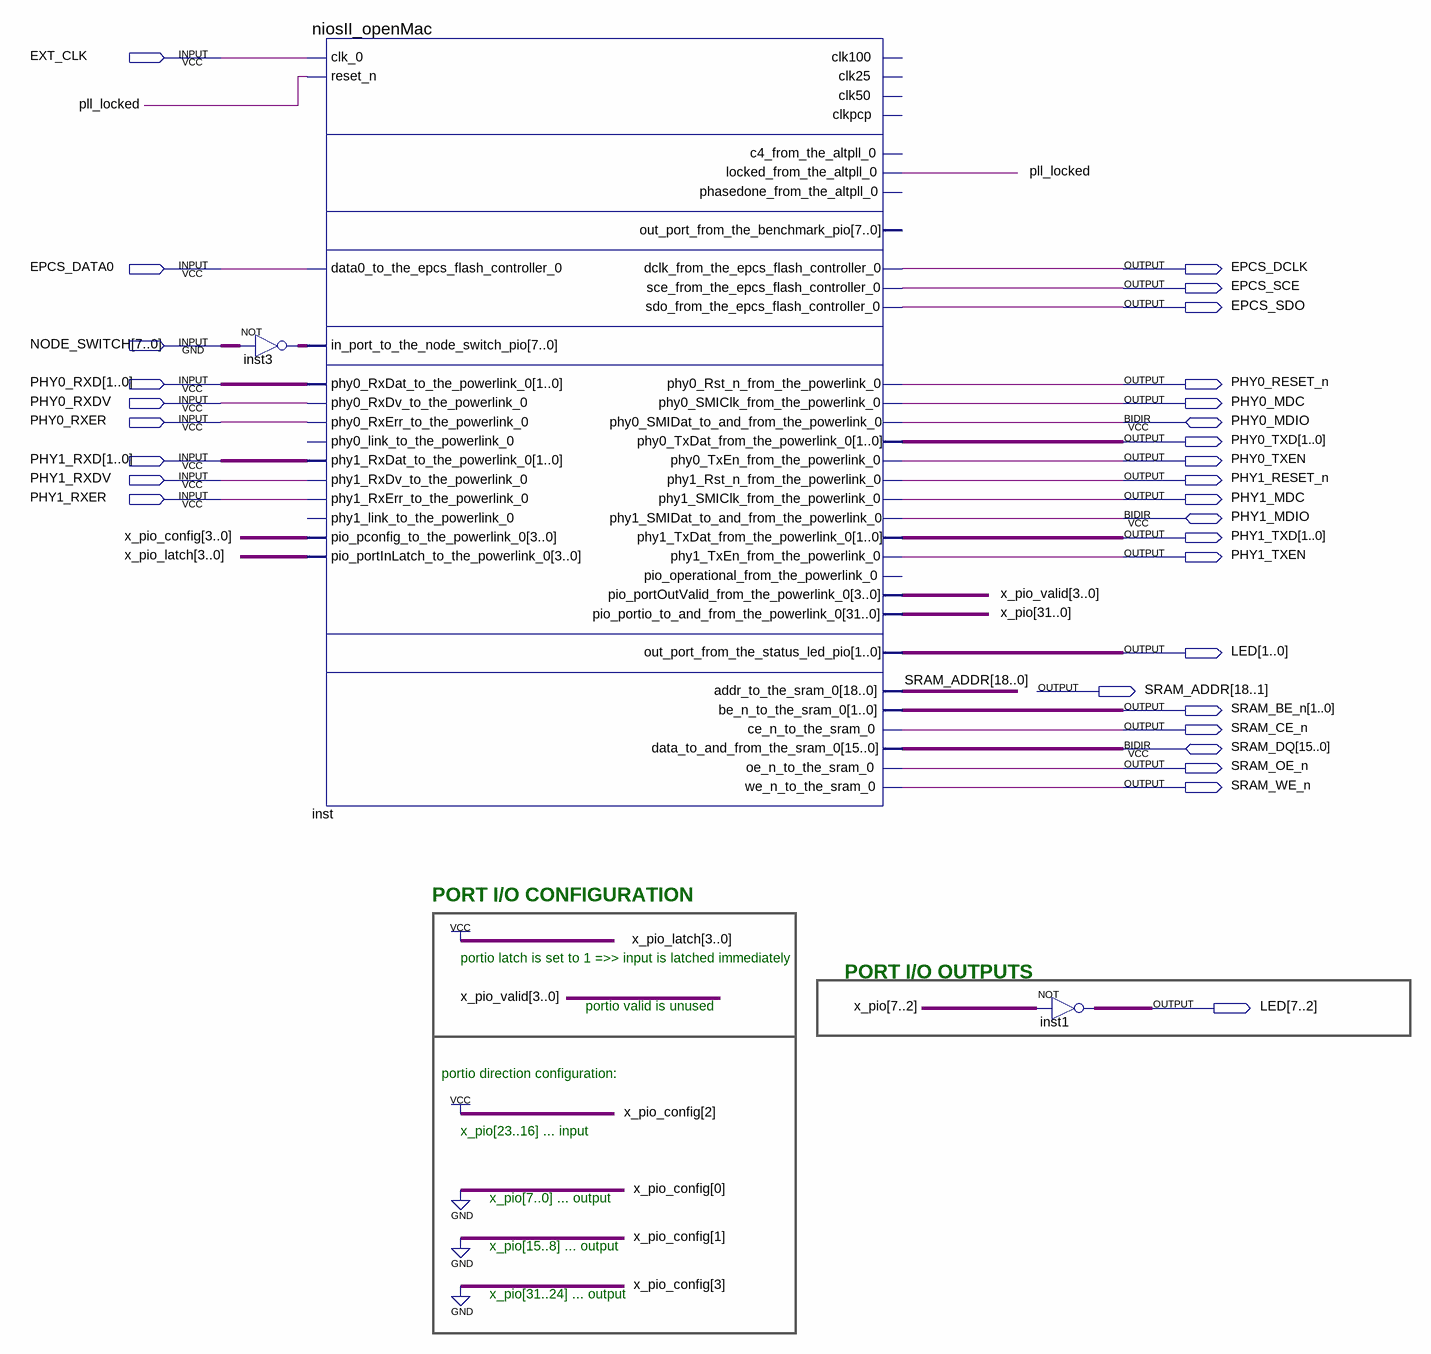
[diagram p0: schematic sheet]
// Quartus schematic nios_pll.bdf as structural Verilog: 3 symbols, 30 pins
module nios_pll (
  input  EXT_CLK,
  input  EPCS_DATA0,
  input  [7:0] NODE_SWITCH,
  input  [1:0] PHY0_RXD,
  input  PHY0_RXDV,
  input  PHY0_RXER,
  input  [1:0] PHY1_RXD,
  input  PHY1_RXDV,
  input  PHY1_RXER,
  inout  PHY0_MDIO,
  inout  PHY1_MDIO,
  inout  [15:0] SRAM_DQ,
  output EPCS_DCLK,
  output EPCS_SCE,
  output EPCS_SDO,
  output PHY0_RESET_n,
  output PHY0_MDC,
  output [1:0] PHY0_TXD,
  output PHY0_TXEN,
  output PHY1_RESET_n,
  output PHY1_MDC,
  output [1:0] PHY1_TXD,
  output PHY1_TXEN,
  output [7:0] LED,
  output [18:0] SRAM_ADDR,
  output [1:0] SRAM_BE_n,
  output SRAM_CE_n,
  output SRAM_OE_n,
  output SRAM_WE_n
);

  wire pll_locked;
  wire [3:0] x_pio_valid;
  wire [7:0] inst3_out;
  wire [31:0] x_pio;

  assign inst3_out = ~NODE_SWITCH;  // NOT inst3, 8 bits wide
  niosII_openMac inst (
    .clk_0(EXT_CLK), .reset_n(pll_locked), .data0_to_the_epcs_flash_controller_0(EPCS_DATA0),
    .in_port_to_the_node_switch_pio(inst3_out), .phy0_RxDat_to_the_powerlink_0(PHY0_RXD),
    .phy0_RxDv_to_the_powerlink_0(PHY0_RXDV), .phy0_RxErr_to_the_powerlink_0(PHY0_RXER),
    .phy1_RxDat_to_the_powerlink_0(PHY1_RXD), .phy1_RxDv_to_the_powerlink_0(PHY1_RXDV),
    .phy1_RxErr_to_the_powerlink_0(PHY1_RXER), .pio_pconfig_to_the_powerlink_0(4'b0100),
    .pio_portInLatch_to_the_powerlink_0(4'b1111), .locked_from_the_altpll_0(pll_locked),
    .dclk_from_the_epcs_flash_controller_0(EPCS_DCLK), .sce_from_the_epcs_flash_controller_0(EPCS_SCE),
    .sdo_from_the_epcs_flash_controller_0(EPCS_SDO), .phy0_Rst_n_from_the_powerlink_0(PHY0_RESET_n),
    .phy0_SMIClk_from_the_powerlink_0(PHY0_MDC), .phy0_TxDat_from_the_powerlink_0(PHY0_TXD),
    .phy0_TxEn_from_the_powerlink_0(PHY0_TXEN), .phy1_Rst_n_from_the_powerlink_0(PHY1_RESET_n),
    .phy1_SMIClk_from_the_powerlink_0(PHY1_MDC), .phy1_TxDat_from_the_powerlink_0(PHY1_TXD),
    .phy1_TxEn_from_the_powerlink_0(PHY1_TXEN), .pio_portOutValid_from_the_powerlink_0(x_pio_valid),
    .out_port_from_the_status_led_pio(LED[1:0]), .addr_to_the_sram_0(SRAM_ADDR),
    .be_n_to_the_sram_0(SRAM_BE_n), .ce_n_to_the_sram_0(SRAM_CE_n), .oe_n_to_the_sram_0(SRAM_OE_n),
    .we_n_to_the_sram_0(SRAM_WE_n), .phy0_SMIDat_to_and_from_the_powerlink_0(PHY0_MDIO),
    .phy1_SMIDat_to_and_from_the_powerlink_0(PHY1_MDIO), .pio_portio_to_and_from_the_powerlink_0(x_pio),
    .data_to_and_from_the_sram_0(SRAM_DQ));  // open: phy0_link_to_the_powerlink_0, phy1_link_to_the_powerlink_0, clk100, clk25, clk50, clkpcp, c4_from_the_altpll_0, phasedone_from_the_altpll_0, out_port_from_the_benchmark_pio, pio_operational_from_the_powerlink_0
  assign LED[7:2] = ~x_pio[7:2];  // NOT inst1, 6 bits wide

  // Notes on the sheet:
  //   PORT I/O CONFIGURATION
  //   portio latch is set to 1 =>> input is latched immediately
  //   PORT I/O OUTPUTS
  //   portio valid is unused
  //   portio direction configuration:
  //   x_pio[23..16] ... input
  //   x_pio[7..0] ... output
  //   x_pio[15..8] ... output
  //   x_pio[31..24] ... output
endmodule
